# Altium project PCB_QrCodeMCU.PrjPcb (part 2 of 2)

## Sheet IMU.SchDoc
size A; SheetNumber: 6; SheetTotal: 6
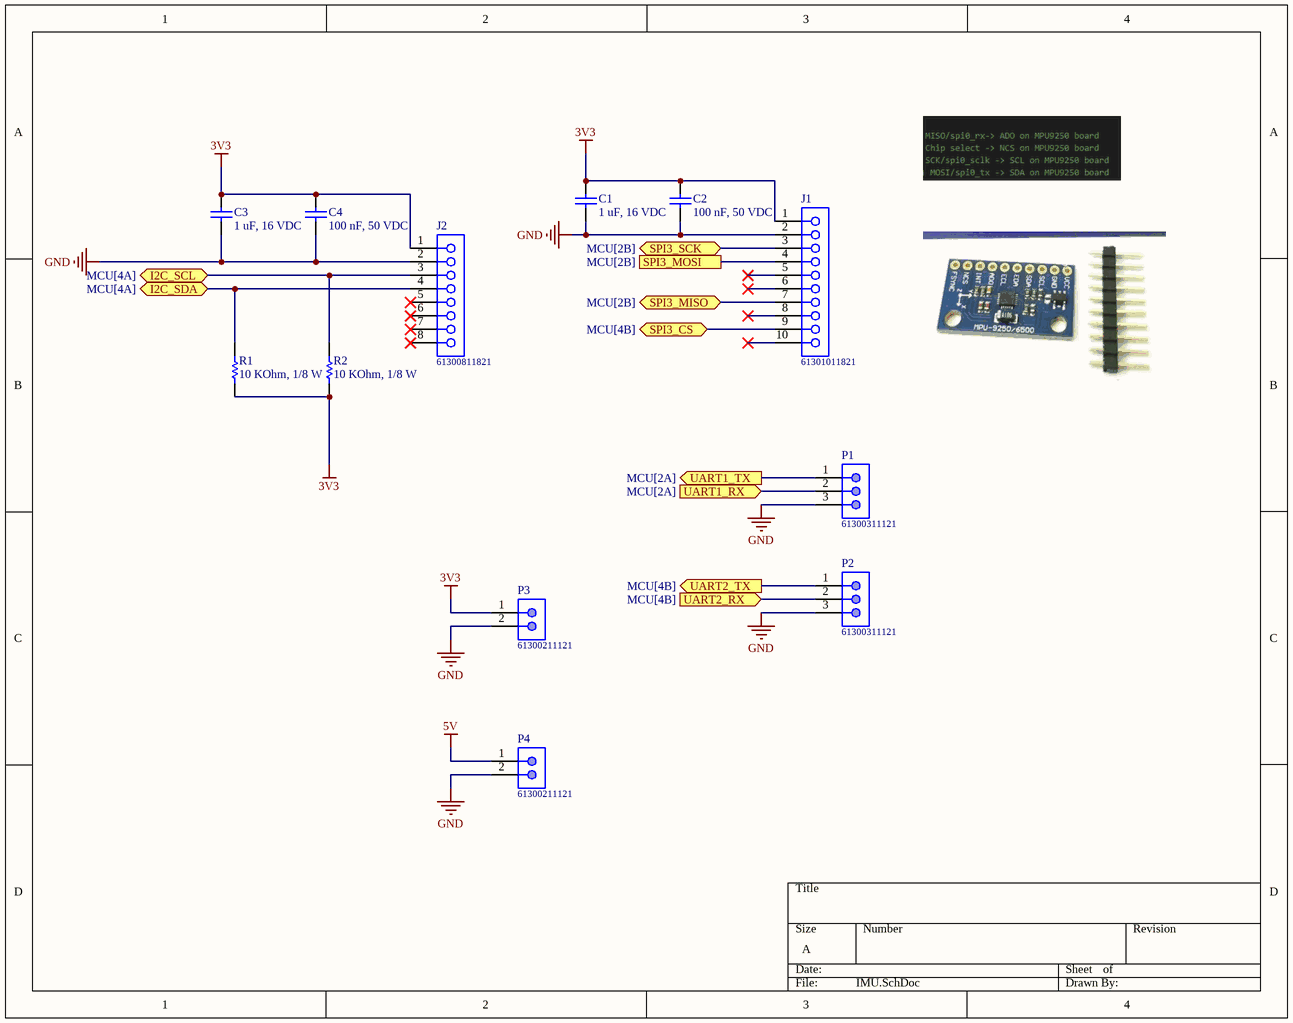
[diagram p5: IMU.SchDoc]

### Parts
C1  1 uF, 16 VDC  [CAP_0805]
C2  100 nF, 50 VDC  [CAP_0805]
C3  1 uF, 16 VDC  [CAP_0805]
C4  100 nF, 50 VDC  [CAP_0805]
J1  61301011821  [61301011821]
J2  61300811821  [61300811821]
P1  61300311121  [61300311121]
P2  61300311121  [61300311121]
P3  61300211121  [61300211121]
P4  61300211121  [61300211121]
R1  10 KOhm, 1/8 W  [RESISTOR_0805]
R2  10 KOhm, 1/8 W  [RESISTOR_0805]

### Ports
I2C_SCL (bidir, see MCU[4A]), I2C_SDA (bidir, see MCU[4A]), SPI3_CS (bidir, see MCU[4B]), SPI3_MISO (bidir, see MCU[2B]), SPI3_MOSI (see MCU[2B]), SPI3_SCK (bidir, see MCU[2B]), UART1_RX (in, see MCU[2A]), UART1_TX (out, see MCU[2A]), UART2_RX (in, see MCU[4B]), UART2_TX (out, see MCU[4B])

### Nets
3V3: C1.2 C2.2 C3.2 C4.2 J1.1 J2.1 P3.1 R1.1 R2.1
5V: P4.1
GND: C1.1 C2.1 C3.1 C4.1 J1.2 J2.2 P1.3 P2.3 P3.2 P4.2
I2C_SCK: J2.4 R1.2 ; port I2C_SDA
I2C_SCL: J2.3 R2.2 ; port I2C_SCL
SPI3_MISO: J1.7 ; port SPI3_MISO
SPI3_MOSI: J1.4 ; port SPI3_MOSI
SPI3_SCK: J1.3 ; port SPI3_SCK
UART1_RX: P1.2 ; port UART1_RX
UART1_TX: P1.1 ; port UART1_TX
UART2_RX: P2.2 ; port UART2_RX
UART2_TX: P2.1 ; port UART2_TX
NetJ1_9: J1.9 ; port SPI3_CS

Not connected (* = marked no-connect by the designer): J1 5* 6* 8* 10*; J2 5* 6* 7* 8*

### Library data of the parts
C1 C3 = 0108051051016: CAP, size 0805, 1 uF, 16 VDC; Manufacture Name: TDK; Manufacture SN: CGA4J2X7R1C105K125AA; Capacitance: 1 uF; Tolerance: +/-10%; Voltage Rating DC: 16 VDC; ComponentLink2Description: Datasheet; ComponentLink2URL: https://product.tdk.com/system/files/dam/doc/product/capacitor/ceramic/mlcc/catalog/mlcc_automotive_general_en.pdf?ref_disty=mouser; Operating Temperature: -55 to +125degC; Packaging: Tape and Reel; Mounting Technology: SMT; Size: 0805; Supplier 1 Name: Mouser; Supplier 1 SN: 810-CGA4J2X7R1C105K; Supplier 1 URL: https://www.mouser.vn/ProductDetail/TDK/CGA4J2X7R1C105K125AA?qs=NRhsANhppD8sFjo%252B1TQuCQ%3D%3D&utm_source=mouser-refine-download&utm_medium=file&utm_campaign=CGA4J2X7R1C105K125AA&utm_content=TDK; Supplier 2 Name: Digi-Key; Supplier 2 SN: 445-5689-2-ND; Supplier 2 URL: https://www.digikey.com/en/products/detail/tdk-corporation/cga4j2x7r1c105k125aa/2443167; Supplier 3 Name: thegioiic; Supplier 3 SN: OEM; Supplier 3 URL: N/A; Value: 1 uF, 16 VDC
C2 C4 = 0108051031050: CAP, size 0805, 100 nF, 50 VDC; Manufacture Name: TDK; Manufacture SN: CGA4C2C0G1H103J060AA; Capacitance: 10 nF; Tolerance: +/-5%; Voltage Rating DC: 50 VDC; Value: 10 nF, 50 VDC; ComponentLink2Description: Datasheet; ComponentLink2URL: https://product.tdk.com/system/files/dam/doc/product/capacitor/ceramic/mlcc/catalog/mlcc_automotive_general_en.pdf?ref_disty=mouser; Operating Temperature: -55 to +125degC; Packaging: Tape and Reel; Mounting Technology: SMT; Size: 0805; Supplier 1 Name: Mouser; Supplier 1 SN: 810-CGA4C2C0G1H103J; Supplier 1 URL: https://www.mouser.vn/ProductDetail/TDK/CGA4C2C0G1H103J060AA?qs=FxQuwy19cyC9M6v0nMqjhA%3D%3D&utm_source=mouser-refine-download&utm_medium=file&utm_campaign=CGA4C2C0G1H103J060AA&utm_content=TDK; Supplier 2 Name: Digi-Key; Supplier 2 SN: 445-6947-2-ND; Supplier 2 URL: https://www.digikey.com/en/products/detail/tdk-corporation/cga4c2c0g1h103j060aa/2672840; Supplier 3 Name: thegioiic; Supplier 3 SN: OEM; Supplier 3 URL: N/A
J1 = 61301011821: WR-PHD Socket Header, THT, pitch 2.54mm, Single Row, Vertical, 10p; Manufacturer: Wurth Elektronik; Pin Number: 10; Rated Current: 3A; Working Voltage: 250VAC; Withstanding Voltage: 500VAC; Contact Resistance: 20mOhm; ComponentLink1Description: Manufacturer; ComponentLink1URL: http://www.we-online.de; ComponentLink2Description: Datasheet; ComponentLink2URL: https://www.we-online.com/catalog/datasheet/61301011821.pdf; Manufacturer Part Number: 61301011821; Published Date: May 2020; Pitch: 2.54mm; Operating Temperature: -40 to +125degC; Mounting Technology: THT; Packaging: Tray; Gender: Socket Header; Row Number: Single; Orientation: Vertical; ComponentLink3Description: Global Supply; ComponentLink3URL: https://www.we-online.com/en/components/products/PHD_2_54_SOCKET_HEADER_6130XX11821?sq=61301011821#61301011821; ComponentLink4Description: Global Supply; ComponentLink4URL: https://www.mouser.vn/ProductDetail/Wurth-Elektronik/61301011821?qs=W%252B2sBeLta1ZhlLR0YCzonQ%3D%3D; ComponentLink5Description: Local Supply; ComponentLink5URL: https://www.thegioiic.com/products?search=H%C3%A0ng%20R%C3%A0o%20C%C3%A1i%202.54mm&page=3; Supplier 1 Name: Mouser; Supplier 1 SN: 710-61301011821; Supplier 1 URL: https://www.mouser.vn/ProductDetail/Wurth-Elektronik/61301011821?qs=W%252B2sBeLta1ZhlLR0YCzonQ%3D%3D; Supplier 2 Name: Digi-Key; Supplier 2 SN: N/A; Supplier 2 URL: N/A; Supplier 3 Name: thegioiic; Supplier 3 SN: N/A; Supplier 3 URL: https://www.thegioiic.com/products?search=H%C3%A0ng%20R%C3%A0o%20C%C3%A1i%202.54mm&page=3
J2 = 61300811821: WR-PHD Socket Header, THT, pitch 2.54mm, Single Row, Vertical, 8p; Manufacturer: Wurth Elektronik; Pin Number: 8; Rated Current: 3A; Working Voltage: 250VAC; Withstanding Voltage: 500VAC; Contact Resistance: 20mOhm; ComponentLink1Description: Manufacturer; ComponentLink1URL: http://www.we-online.de; ComponentLink2Description: Datasheet; ComponentLink2URL: https://www.we-online.com/catalog/datasheet/61300811821.pdf; Manufacturer Part Number: 61300811821; Published Date: May 2020; Pitch: 2.54mm; Operating Temperature: -40 to +125degC; Mounting Technology: THT; Packaging: Tray; Gender: Socket Header; Row Number: Single; Orientation: Vertical; ComponentLink3Description: Global Supply; ComponentLink3URL: https://www.we-online.com/en/components/products/PHD_2_54_SOCKET_HEADER_6130XX11821?sq=61300811821#61300811821; ComponentLink4Description: Global Supply; ComponentLink4URL: https://www.mouser.vn/ProductDetail/Wurth-Elektronik/61300811821?qs=ulEaXIWI0c%252BOxrSqc7jVmQ%3D%3D; ComponentLink5Description: Local Supply; ComponentLink5URL: https://www.thegioiic.com/hang-rao-cai-don-2-54mm-8-chan-1-hang-cao-11-8mm-xuyen-lo; Supplier 1 Name: Mouser; Supplier 1 SN: 710-61300811821; Supplier 1 URL: https://www.mouser.vn/ProductDetail/Wurth-Elektronik/61300811821?qs=ulEaXIWI0c%252BOxrSqc7jVmQ%3D%3D; Supplier 2 Name: Digi-Key; Supplier 2 SN: N/A; Supplier 2 URL: N/A; Supplier 3 Name: thegioiic; Supplier 3 SN: N/A; Supplier 3 URL: https://www.thegioiic.com/hang-rao-cai-don-2-54mm-8-chan-1-hang-cao-11-8mm-xuyen-lo
P1 P2 = 61300311121: WR-PHD Pin Header, THT, pitch 2.54mm, Single Row, Vertical, 3p; Manufacturer: Wurth Elektronik; Pin Number: 3; Rated Current: 3A; Working Voltage: 250VAC; Withstanding Voltage: 500VAC; Contact Resistance: 20mOhm; Supply Name 1: Mouser; ComponentLink1Description: Manufacturer; ComponentLink1URL: http://www.we-online.de; ComponentLink2Description: Datasheet; ComponentLink2URL: https://www.we-online.com/catalog/datasheet/61300311121.pdf; Manufacturer Part Number: 61300311121; Published Date: May 2020; Pitch: 2.54mm; Operating Temperature: -40 to +105degC; Mounting Technology: THT; Packaging: Bag; Gender: Pin Header; Row Number: Single; Orientation: Vertical; ComponentLink3Description: Global Supply; ComponentLink3URL: https://www.mouser.vn/ProductDetail/Wurth-Elektronik/61300311121?qs=PhR8RmCirEYxRWFJzNKsUw%3D%3D; Supplier 1 Name: Mouser; Supplier 1 SN: 710-61300311121; Supplier 1 URL: https://www.mouser.vn/ProductDetail/Wurth-Elektronik/61300311121?qs=PhR8RmCirEYxRWFJzNKsUw%3D%3D; Supplier 2 Name: Digi-Key; Supplier 2 SN: N/A; Supplier 2 URL: N/A; Supplier 3 Name: thegioiic; Supplier 3 SN: N/A; Supplier 3 URL: N/A
P3 P4 = 61300211121: WR-PHD Pin Header, THT, pitch 2.54mm, Single Row, Vertical, 2p; Manufacturer: Wurth Elektronik; Pin Number: 2; Rated Current: 3A; Working Voltage: 250VAC; Withstanding Voltage: 500VAC; Contact Resistance: 20mOhm; Supply Name 1: Mouser; ComponentLink1Description: Manufacturer; ComponentLink1URL: http://www.we-online.de; ComponentLink2Description: Datasheet; ComponentLink2URL: https://www.we-online.com/catalog/datasheet/61300211121.pdf; Manufacturer Part Number: 61300211121; Published Date: May 2020; Pitch: 2.54mm; Operating Temperature: -40 to +105degC; Mounting Technology: THT; Packaging: Bag; Gender: Pin Header; Row Number: Single; Orientation: Vertical; ComponentLink3Description: Global Supply; ComponentLink3URL: https://www.mouser.vn/ProductDetail/Wurth-Elektronik/61300211121?qs=t4813l51qx%252B1A5GYDQxPlw%3D%3D; Supplier 1 Name: Mouser; Supplier 1 SN: 710-61300211121; Supplier 1 URL: https://www.mouser.vn/ProductDetail/Wurth-Elektronik/61300211121?qs=t4813l51qx%252B1A5GYDQxPlw%3D%3D; Supplier 2 Name: Digi-Key; Supplier 2 SN: N/A; Supplier 2 URL: N/A; Supplier 3 Name: thegioiic; Supplier 3 SN: N/A; Supplier 3 URL: N/A
R1 R2 = 0008051031: RES, size 0805, 10 KOhm, 1/8 W; Resistance tolerance: +/-1%; Rated Power: 1/8 W; Resistance: 10 KOhm; Size: 0805; Mounting Technology: SMT; Supplier 1 Name: Mouser; Supplier 1 SN: N/A; Supplier 1 URL: N/A; Supplier 2 Name: Digi-Key; Supplier 2 SN: N/A; Supplier 2 URL: N/A; Supplier 3 Name: Thegioiic; Supplier 3 SN: N/A; Supplier 3 URL: https://www.thegioiic.com/dien-tro-1-kohm-0805-1; Manufacture  Name: N/A; Manufacture  SN: N/A; Value: 10 KOhm, 1/8 W; ComponentLink1Description: Datasheet link; ComponentLink1URL: N/A; ComponentLink2Description: Supplier 1 URL; ComponentLink2URL: N/A; ComponentLink3Description: Supplier 2 URL; ComponentLink3URL: N/A; ComponentLink4Description: Supplier 3 URL; ComponentLink4URL: https://www.thegioiic.com/dien-tro-1-kohm-0805-1

## Nets that join several sheets
3V3: Power (7 pins), MCU (22 pins), Motor (8 pins), IMU (9 pins)
5V: Power (8 pins), IMU (P4.1)
GND: Power (25 pins), MCU (26 pins), Motor (24 pins), IMU (10 pins)
EN_1A: MCU (U1.40), Motor (U3.12)
EN_1B: MCU (U1.42), Motor (U3.11)
EN_2A: MCU (U1.31), Motor (U3.14)
EN_2B: MCU (U1.32), Motor (U3.13)
EN_3A: MCU (U1.30), Motor (U3.16)
EN_3B: MCU (U1.89), Motor (U3.15)
EN_4A: MCU (U1.23), Motor (U3.18)
EN_4B: MCU (U1.24), Motor (U3.17)
I2C_SCK: MCU (U1.93), IMU (J2.4 R1.2)
I2C_SCL: MCU (U1.92), IMU (J2.3 R2.2)
NetJ1_9: MCU (U1.81), IMU (J1.9)
PWM1: MCU (U1.59), Motor (R9.2 U2.9)
PWM2: MCU (U1.60), Motor (R10.2 U2.8)
PWM3: MCU (U1.61), Motor (R11.2 U2.7)
PWM4: MCU (U1.62), Motor (R12.2 U2.6)
PWM5: MCU (U1.63), Motor (R13.2 U2.5)
PWM6: MCU (U1.64), Motor (R14.2 U2.4)
PWM7: MCU (U1.65), Motor (R15.2 U2.3)
PWM8: MCU (U1.66), Motor (R16.2 U2.2)
SPI3_MISO: MCU (U1.79), IMU (J1.7)
SPI3_MOSI: MCU (U1.80), IMU (J1.4)
SPI3_SCK: MCU (U1.78), IMU (J1.3)
UART1_RX: MCU (U1.69), IMU (P1.2)
UART1_TX: MCU (U1.68), IMU (P1.1)
UART2_RX: MCU (U1.87), IMU (P2.2)
UART2_TX: MCU (U1.86), IMU (P2.1)